# Altium project Boost Converter UVEEC.PrjPcb
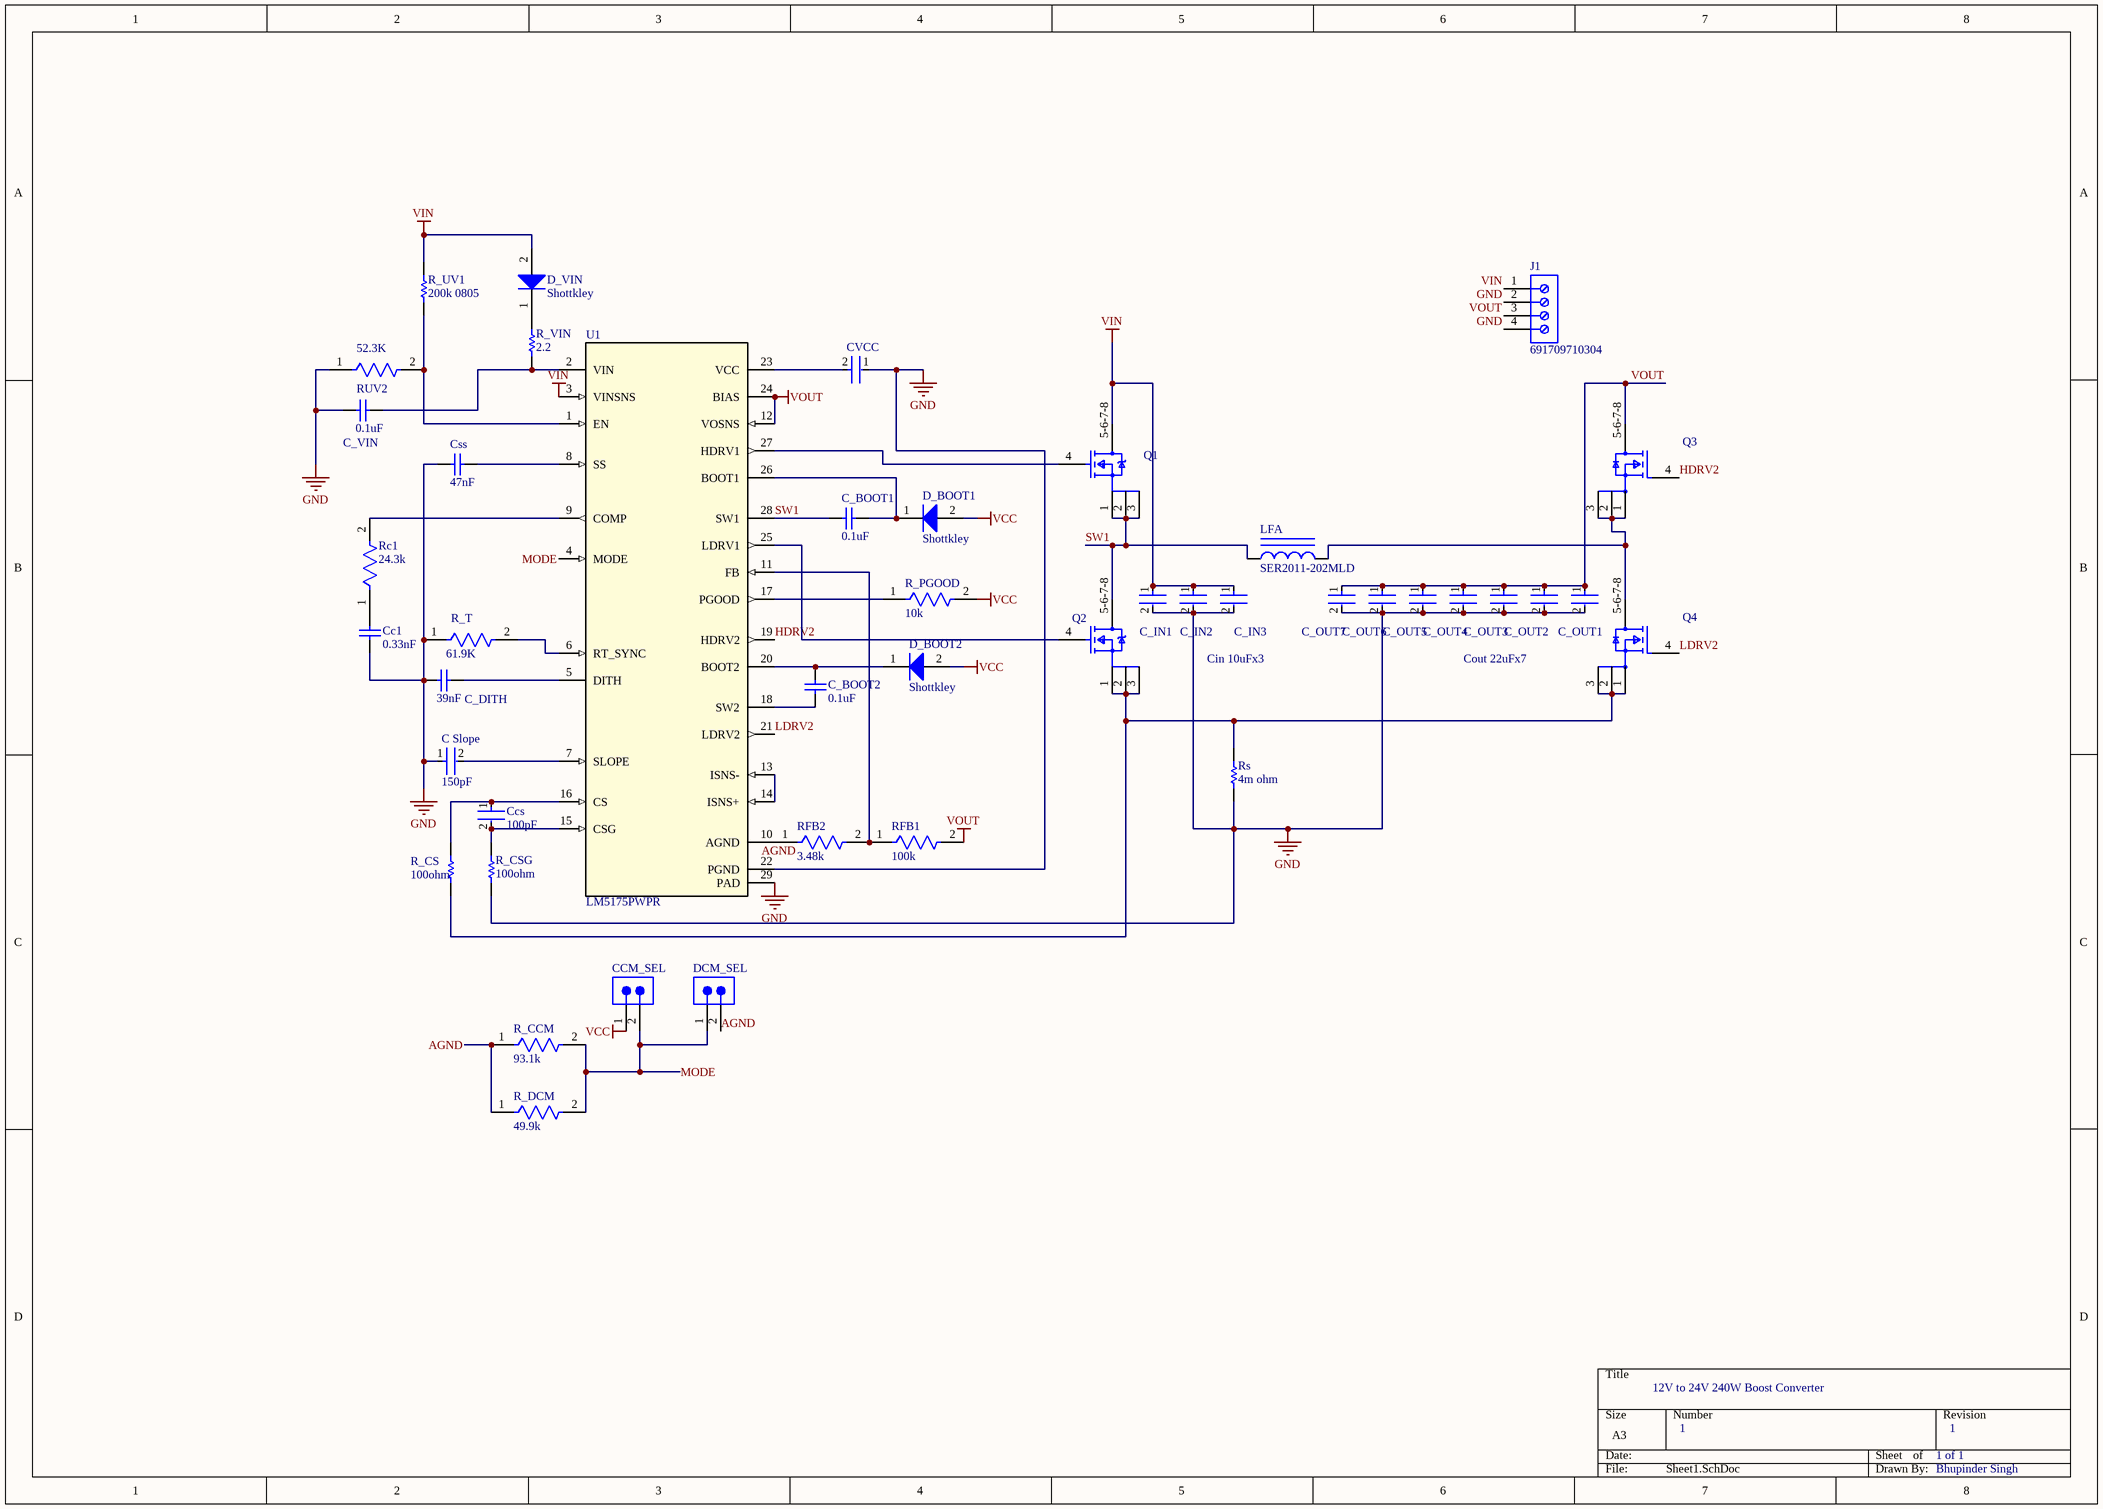
[diagram p0: Sheet1.SchDoc]
1 sheet, 44 parts. Net scope: global (net labels, ports and power ports of the same name join across sheets).

## Sheet Sheet1.SchDoc
size A3; SheetNumber: 1; SheetTotal: 1

### Parts
52.3K  RUV2  [FP-RG2012-IPC_A]
C_BOOT1  0.1uF  [CAPC1608X90X35ML10T15]
C_BOOT2  0.1uF  [CAPC1608X90X35ML10T15]
C_DITH  39nF  [CAPC1608X90X35NL15T15]
C_IN1  C0805C106K8PACTU  [FP-C0805C-DG-MFG]  (value not drawn)
C_IN2  C0805C106K8PACTU  [FP-C0805C-DG-MFG]  (value not drawn)
C_IN3  C0805C106K8PACTU  [FP-C0805C-DG-MFG]  (value not drawn)
C_OUT1  GRM21BR60J226ME39L  [FP-GRM21B-0_15-MFG]  (value not drawn)
C_OUT2  GRM21BR60J226ME39L  [FP-GRM21B-0_15-MFG]  (value not drawn)
C_OUT3  GRM21BR60J226ME39L  [FP-GRM21B-0_15-MFG]  (value not drawn)
C_OUT4  GRM21BR60J226ME39L  [FP-GRM21B-0_15-MFG]  (value not drawn)
C_OUT5  GRM21BR60J226ME39L  [FP-GRM21B-0_15-MFG]  (value not drawn)
C_OUT6  GRM21BR60J226ME39L  [FP-GRM21B-0_15-MFG]  (value not drawn)
C_OUT7  GRM21BR60J226ME39L  [FP-GRM21B-0_15-MFG]  (value not drawn)
C_Slope  150pF  [FP-0805-L_2_01_0_2-W_1_25-IPC_B]
C_VIN  0.1uF  [CAPC1608X90X35ML10T15]
Cc1  0.33nF  [CAPC1608X92X38LL15T08]
CCM_SEL  61300211121  [61300211121]  (value not drawn)
Ccs  100pF  [FP-C0805C-DN-MFG]
Css  47nF  [CAPC1608X90X35NL15T15]
CVCC  C1608X5R1H105K080AB  [FP-C1608-080-0_1-IPC_B]  (value not drawn)
D_BOOT1  Shottkley  [ONSC-SOD-323-2-477-02_V]
D_BOOT2  Shottkley  [ONSC-SOD-323-2-477-02_V]
D_VIN  Shottkley  [ONSC-SOD-323-2-477-02_V]
DCM_SEL  61300211121  [61300211121]  (value not drawn)
J1  691709710304  [691709710304]
LF  SER2011-202MLD  [COIL-SER2011-3_V]  (part A of 2)
Q1  CSD18563Q5A  [FP-DQJ0008A-MFG]  (value not drawn)
Q2  CSD18563Q5A  [FP-DQJ0008A-MFG]  (value not drawn)
Q3  CSD16321Q5  [FP-DQH0008A-0]  (value not drawn)
Q4  CSD16321Q5  [FP-DQH0008A-0]  (value not drawn)
R_CCM  93.1k  [FP-RN732A-MFG]
R_CS  100ohm  [RESC1608X55X30LL15T15]
R_CSG  100ohm  [RESC1608X55X30LL15T15]
R_DCM  49.9k  [FP-CRCW0805-e3-IPC_C]
R_PGOOD  10k  [FP-RR0510-MFG]
R_T  61.9K  [FP-RG2012-IPC_A]
R_UV1  200k 0805  [RESC2013X70X40LL20T20]
R_VIN  2.2  [RESC1609X50X30LL10T20]
Rc1  24.3k  [FP-CR1206-MFG]
RFB1  100k  [FP-RC0603-0_55-MFG]
RFB2  3.48k  [FP-ERA3A-IPC_A]
Rs  value 4m ohm  (hidden comment: Resistor)
U1  LM5175PWPR  [PWP0028F_N]

### Nets
GND: 52.3K.1 C_DITH.1 C_IN1.2 C_IN2.2 C_IN3.2 C_OUT1.2 C_OUT2.2 C_OUT3.2 C_OUT4.2 C_OUT5.2 C_OUT6.2 C_OUT7.2 C_Slope.1 C_VIN.1 Cc1.1 Css.1 CVCC.1 J1.2 J1.4 R_CSG.1 R_T.1 Rs.1 U1.22(PGND) U1.29(PAD)
VCC: CCM_SEL.1 D_BOOT1.2(A) D_BOOT2.2(A) R_PGOOD.2
VIN: C_IN1.1 C_IN2.1 C_IN3.1 D_VIN.2(A) J1.1 Q1.5-6-7-8(D) R_UV1.2 U1.3(VINSNS)
VOUT: C_OUT1.1 C_OUT2.1 C_OUT3.1 C_OUT4.1 C_OUT5.1 C_OUT6.1 C_OUT7.1 J1.3 Q3.5-6-7-8(D) RFB1.2 U1.12(VOSNS) U1.24(BIAS)
AGND: DCM_SEL.2 R_CCM.1 R_DCM.1
HDRV2: Q3.4(G) U1.19(HDRV2)
LDRV2: Q4.4(G) U1.21(LDRV2)
MODE: CCM_SEL.2 DCM_SEL.1 R_CCM.2 R_DCM.2 U1.4(MODE)
SW1: C_BOOT1.1 LF.1 Q1.1(S) Q1.2(S) Q1.3(S) Q2.5-6-7-8(D) U1.28(SW1)
Net52.3K_2: 52.3K.2 R_UV1.1 U1.1(EN)
NetC_BOOT1_2: C_BOOT1.2 D_BOOT1.1(K) U1.26(BOOT1)
NetC_BOOT2_1: C_BOOT2.1 D_BOOT2.1(K) U1.20(BOOT2)
NetC_BOOT2_2: C_BOOT2.2 U1.18(SW2)
NetC_DITH_2: C_DITH.2 U1.5(DITH)
NetC_Slope_2: C_Slope.2 U1.7(SLOPE)
NetC_VIN_2: C_VIN.2 R_VIN.1 U1.2(VIN)
NetCc1_2: Cc1.2 Rc1.1
NetCcs_1: Ccs.1 R_CS.2 U1.16(CS)
NetCcs_2: Ccs.2 R_CSG.2 U1.15(CSG)
NetCss_2: Css.2 U1.8(SS)
NetCVCC_2: CVCC.2 U1.23(VCC)
NetD_VIN_1: D_VIN.1(K) R_VIN.2
NetLF_2: LF.2 Q3.1(S) Q3.2(S) Q3.3(S) Q4.5-6-7-8(D)
NetQ1_4: Q1.4(G) U1.27(HDRV1)
NetQ2_1: Q2.1(S) Q2.2(S) Q2.3(S) Q4.1(S) Q4.2(S) Q4.3(S) R_CS.1 Rs.2
NetQ2_4: Q2.4(G) U1.25(LDRV1)
NetR_PGOOD_1: R_PGOOD.1 U1.17(PGOOD)
NetR_T_2: R_T.2 U1.6(RT_SYNC)
NetRc1_2: Rc1.2 U1.9(COMP)
NetRFB1_1: RFB1.1 RFB2.2 U1.11(FB)
NetRFB2_1: RFB2.1 U1.10(AGND)
NetU1_13: U1.13(ISNS-) U1.14(ISNS+)

### Notes on the sheet
- Cin 10uFx3
- Cout 22uFx7
- 12V to 24V 240W Boost Converter
- 1
- 1 of 1
- Bhupinder Singh
- Labels drawn without touching a wire or pin: AGND

### Library data of the parts
52.3K = CMP-28537-010509-1: Automotive Metal Thin Film Chip Resistor, 0805, 52.3kΩ, 0.1%, 25ppm/°C, 0.125W, 150V; Power Rating: 125mW; Resistance: 52.3kR; Height: 0.4mm; Voltage Rating (DC): 150V; Voltage Rating: 150V; Weight: 0.000194oz; Case Code (Metric): 2012; Features: Automotive AEC-Q200; Number of Terminations: 2; Temperature Coefficient: 25ppm/°C; Width: 1.2mm; Termination: SMD/SMT; Min Operating Temperature: -55°C; Resistor Type: Thin Film; Tolerance: 0.1%; Lead Free: Lead Free; Length: 2mm; Packaging: Tape and Reel; Max Power Dissipation: 125mW; RoHS Compliant: Yes; Series: RG; Max Operating Temperature: 155°C; Case/Package: 0805; Case Code (Imperial): 0805
C_BOOT1 C_BOOT2 C_VIN = CMP-2100-03643-1: Chip Capacitor, 0.1 uF, +/- 10%, 50 V, -55 to 125 degC, 0603 (1608 Metric), RoHS, Tape and Reel; Manufacturer: Murata; Dielectric Material: Ceramic; Voltage Rating: 50V; Capacitance: 100nF; Dielectric: X7R; Insulation Resistance: 10GR; Value: 100nF; Case Code (Metric): 1608; Lead Free: LeadFree; Depth: 0.8mm; Number of Pins: 2; Radiation Hardening: No; Case/Package: 0603; Manufacturer URL: http://www.murata.com/; Packaging: TapeandReel; Length: 1.6mm; Contact Plating: Tin; Datasheet URL: http://psearch.en.murata.com/capacitor/product/GRM188R71H104KA93%23.pdf; Tolerance: 10%; Case Code (Imperial): 0603; Min Operating Temperature: -55degC; RoHSCompliant: true; Voltage: 50V; Termination: SMD/SMT; Mount: SurfaceMount; Material: Ceramic; Package Quantity: 1; Height: 0.8mm; Thickness: 0.035inch; REACH SVHC: NoSVHC; Max Operating Temperature: 125degC; Width: 0.8mm; Package Reference: 0603; Voltage Rating (DC): 50V; Datasheet Version: 42675.0; Package Description: 2-Pin Surface Mount Device, Body 1.6 x 0.8 mm
C_DITH = CMP-2006-04434-1: Manufacturer: AVX Interconnect / Elco; Part Number: 06035C393KAT2A
C_IN1-C_IN3 = CMP-2007-03243-2: CAP CER 10UF 10V X5R 0805; Manufacturer: Kemet; 3DS Part Number: 220-00001; Tolerance: 10%; Temperature Coefficient: 15%; Device Class L2: Capacitors; Device Class L1: Passive Components; ComponentLink2URL: https://content.kemet.com/datasheets/KEM_C1006_X5R_SMD.pdf; Height: 1.4mm; Lead Free: Yes; Manufacturer Part Number: C0805C106K8PACTU; Digikey Description: CAP CER 10UF 10V X5R 0805; Octopart: https://octopart.com/c0805c106k8pactu-kemet-98697; Capacitance: 10uF; Value: 10uF; Temperature Range Low: -55°C; Temperature: -55°C to +85°C; Automotive: No; Mouser Description: CAP CER 10UF 10V X5R 0805; Ipc Land Pattern Name: CAPC200125X125; Material: Ceramic; Temperature Range High: +85°C; Voltage: 10V; RoHS: TRUE; Device Class L3: Ceramic Capacitors; ComponentLink2Description: Datasheet; Voltage Rating: 10V; Package: C0805C-DG; Temperature Characteristic: X5R; Category: Cap
C_OUT1-C_OUT7 = CMP-2007-03385-2: Chip Multilayer Ceramic Capacitors for General Purpose, 0805, 22uF, X5R, 15%, 20%, 6.3V; Material: Ceramic; Max Operating Temperature: 85°C; Voltage: 6.3V; Min Operating Temperature: -55°C; Case/Package: 0805; Thickness: 0.053inch; Dielectric: X5R; Packaging: Tape and Reel; Depth: 1.25mm; Termination: SMD/SMT; Voltage Rating (DC): 6.3V; Radiation Hardening: No; Tolerance: 20%; Mount: Surface Mount; Lead Free: Lead Free; Package Quantity: 1; REACH SVHC: No SVHC; Voltage Rating: 6.3V; Capacitance: 22uF; Length: 2mm; Case Code (Imperial): 0805; Case Code (Metric): 2012; Width: 0.049inch; Height: 1.25mm; Value: 22uF
C_Slope = CMP-2007-04584-2: General Purpose Ceramic Capacitor, 0805, 150pF, 5%, C0G, 30ppm/°C, 200V; Dissipation Factor: 10%; Depth: 1.25mm; Contact Plating: Tin; Number of Pins: 2; Width: 1.25mm; Tolerance: 5%; Mount: Surface Mount; REACH SVHC: No SVHC; Voltage Rating (DC): 200V; Dielectric: C0G; Height: 0.94mm; Max Operating Temperature: 125°C; Package Quantity: 1; Temperature Coefficient: 30ppm/°C; RoHS Compliant: Yes; Series: -; Lead Free: Lead Free; Thickness: 0.037inch; Voltage Rating: 200V; Case Code (Imperial): 0805; Capacitance: 150pF; Min Operating Temperature: -55°C; Radiation Hardening: No; Length: 2.01mm; Construction: Flat; Case/Package: 0805; Packaging: Tape and Reel; Case Code (Metric): 2012; Voltage: 200V; Termination: SMD/SMT
Cc1 = CMP-2006-01514-1: Manufacturer: Vitramon; Part Number: VJ0603D331KXAAJ
CCM_SEL DCM_SEL = CMP-1712-00002-5: NexarPartId: 20081794; Operating Supply Voltage: 250V; Current Rating: 3A; Gender: Male; Number of Contacts: 2; Pitch: 2.54mm; Connector Type: Male Pin; Contact Resistance: 20mΩ; Contact Plating: Gold; Contact Material: Copper; Number of Pins: 2; Min Operating Temperature: -40°C; Packaging: Bulk; Lead Pitch: 2.54mm; Mount: Through Hole; Orientation: Vertical; RoHS: Compliant; REACH SVHC: No SVHC; Height: 8.94mm; Termination: Through Hole; Number of Positions: 2; Contact Mating Length: 5.9944mm; Color: Black; Contact Gender: Male; Number of Rows: 1; Housing Material: PBT; Lead Free: Lead Free; Voltage Rating: 250V; Max Operating Temperature: 125°C
Ccs = CMP-03020-014281-1: CAP CER 100PF 100V C0G/NP0 0805; Manufacturer: KEMET; Manufacturer Part Number: C0805C101J1GACTU; Temperature Coefficient: 30ppm/°C; Temperature Characteristic: C0G; Tolerance: 0.05; RoHS: TRUE; ComponentLink2URL: https://content.kemet.com/datasheets/KEM_C1003_C0G_SMD.pdf; Voltage Rating: 100 V; Height: 0.88mm; Capacitance: 100 pF; Device Class L3: Ceramic Capacitors; Temperature: -55°C to +125°C; Digikey Description: CAP CER 100PF 100V C0G/NP0 0805; Device Class L1: Passive Components; Lead Free: Yes; Package: C0805C-DN; Octopart: https://octopart.com/c0805c101j1gactu-kemet-123666; Automotive: No; Category: Cap; Temperature Range High: +125°C; Mouser Description: Multilayer Ceramic Capacitors MLCC - SMD/SMT 100volts 100pF C0G 5%; Temperature Range Low: -55°C; ComponentLink2Description: Datasheet; Ipc Land Pattern Name: CAPC200125X78; Material: Ceramic; Device Class L2: Capacitors; Value: 100 pF
Css = CMP-2006-02074-1: Part Number: 06035C473KAZ2A; Manufacturer: AVX Interconnect / Elco
CVCC = CMP-2000-06025-2: Multilayer Ceramic Capacitors 1μF ±10% 50V X5R SMD 0603; Capacitance: 1uF; Value: 1uF; Lead Free: Lead Free; Height: 0.8mm; Mount: Surface Mount; Radiation Hardening: No; Thickness: 0.035inch; Length: 1.6mm; Max Operating Temperature: 85°C; REACH SVHC: No SVHC; Min Operating Temperature: -55°C; Construction: Flat; RoHS Compliant: Yes; Voltage Rating: 50V; Dielectric: X5R; Packaging: Tape and Reel; Termination: SMD/SMT; Voltage Rating (DC): 50V; Case Code (Imperial): 0603; Voltage: 50V; Width: 0.031inch; Weight: 7.1E-05oz; Depth: 0.8mm; Case Code (Metric): 1608; Series: C; Case/Package: 0603; Tolerance: 10%; Resistor Type: Ceramic; Number of Pins: 2; Dielectric Material: Ceramic; Package Quantity: 1
D_BOOT1 D_BOOT2 D_VIN = CMP-1055-00462-1: Schottky Barrier Diode, 2-Pin SOD-323, Pb-Free, Tape and Reel; PartNumber: BAT54HT1G; Manufacturer: On Semiconductor; Configuration: Single; trr Max (ns): 5; IFSM Max (A): 0.6; ComponentLink3URL: http://www.onsemi.com/pub_link/Collateral/477-02.PDF.1; PackageDescription: 2-Pin SOD, Body 1.7 x 1.25 mm; ComponentLink2URL: http://www.onsemi.cn/pub_link/Collateral/BAT54HT1-D.PDF; ComponentLink3Description: Package Specification; ComponentLink2Description: Datasheet; DatasheetVersion: Rev. 6; PackageReference: SOD-323-2-477-02; RoHS: TRUE; ComponentLink1URL: http://www.onsemi.com/; Packing: Tape and Reel; Mounting Technology: Surface Mount; ComponentLink1Description: Manufacturer URL; PackageVersion: Rev. H, 03/2007
J1 = CMP-1502-03337-2: NexarPartId: 34171771; Current: 6A; Voltage: 300V; Number of Positions Per Level: 4; Plating: Steel; Wire Gauge (Max): 30AWG; Pitch: 5mm; Connector Type: Screw; Number of Levels: 1; Color: Black; Lead Pitch: 5mm; Mount: Surface Mount; Flammability Rating: UL94 V-0; Termination: Screw; Housing Material: Nylon; Min Operating Temperature: -40°C; REACH SVHC: Unknown; Number of Pins: 4; Contact Plating: Tin; Packaging: Digi-Reel®; Height: 10.2mm; Number of Rows: 1; Number of Positions: 4; Contact Material: Nickel; Current Rating: 6A; Wire Gauge (Min): 30AWG; Voltage Rating: 300V; Length: 20mm; Wire/Cable Gauge: 30AWG; RoHS: Compliant; Number of Contacts: 4; Max Operating Temperature: 130°C
LF = CMP-0837-00036-1: Shielded Power Inductor, 2 uH, +/- 20%, 1.2 mOhm, 56 MHz, 37 A, -40 to 125 degC, 3-Pin SMD, RoHS, Reel; Manufacturer: Coilcraft; DCR typ (mOhm): 1.2; SRF typ (MHz): 56; Inductance +/- 20% (uH): 2; Isat (A): 37; ComponentLink3Description: Package Specification; Ambient Temperature with Derated Current: 85 to 125 degC; Mounting Technology: Surface Mount; PackageReference: SER2011-3; PartNumber: SER2011-202MLD; Packing: Reel; DatasheetVersion: 09/2012; PackageDescription: 3-Pin SMD, Body 19.18 x 9.27 mm, Height 10.67 mm; ComponentLink2URL: http://www.coilcraft.com/pdfs/ser2000.pdf; ComponentLink3URL: http://www.coilcraft.com/pdfs/ser2000.pdf; Ambient Temperature with Irms Current: -40 to 85 degC; PackageVersion: 09/2012; ComponentLink1URL: http://www.coilcraft.com/; ComponentLink1Description: Manufacturer URL; RoHS: TRUE; ComponentLink2Description: Datasheet
Q1 Q2 = CMP-04962-000004-1: MOSFET N-CH 60V 100A 8SON; Manufacturer: Texas Instruments; Threshold Vgs Max: 2.4V; Number Of Channels: 1; Input Capacitace At Vds: 1150pF @ 30V; Gate Charge At Vgs: 15nC @ 10V; Reverse Recovery Charge: 63nC; Max Junction Temp: +150°C; Max Forward Diode Voltage: 1V; Power Dissipation: 3.2W; Reverse Recovery Time: 49ns; Rthja Max: 50°C/W; Typ Forward Diode Voltage: 0.8V; Turn On Delay Time: 3.2ns; Threshold Vgs Min: 1.7V; Drain To Source Resistance: 5.7mΩ; Turn Off Delay Time: 11.4ns; Transconductance: 60S; Gate To Source Voltage: 20V; Continuous Drain Current: 15A; Package: DQJ0008A; Temperature Range High: +150°C; Device Class L3: MOSFETs; Device Class L2: Transistors; Manufacturer Part Number: CSD18563Q5A; RoHS: TRUE; Number Of N Channels: 1; Automotive: No; Lead Free: Yes; Digikey Description: MOSFET N-CH 60V 100A 8SON; Drain To Source Breakdown Voltage: 60V; Temperature Range Low: -55°C; Temperature: -55°C to +150°C; Category: Trans; Device Class L1: Discrete Semiconductors; Height: 1.1mm; Octopart: https://octopart.com/csd18563q5a-texas+instruments-30331677; ComponentLink2Description: Datasheet; ComponentLink2URL: http://www.ti.com/lit/ds/symlink/csd18563q5a.pdf; Drain To Source Voltage: 60V; Mouser Description: MOSFET 60V N-Channel NexFET Power MOSFET
Q3 Q4 = CMP-04962-000020-1: MOSFET N-CH 25V 31A/100A 8VSON; Rise Time: 15ns; Turn-Off Delay Time: 27ns; Drain to Source Resistance: 2.4mR; Gate to Source Voltage (Vgs): 10V; Turn-On Delay Time: 9ns; Threshold Voltage: 1.1V; Number of Elements: 1; Max Power Dissipation: 3.1W; Input Capacitance: 3.1nF; Continuous Drain Current (ID): 100A; Fall Time: 17ns; Element Configuration: Single; Polarity: N-CHANNEL; Package Quantity: 1; Lead Free: Contains Lead; Case/Package: SON; Radiation Hardening: No; Width: 5.1mm; Dual Supply Voltage: 25V; Series: NexFET™; RoHS Compliant: Yes; Termination: SMD/SMT; Min Operating Temperature: -55°C; Contact Plating: Tin; Packaging: Tape and Reel; Nominal Vgs: 1.1V; Number of Pins: 8; Mount: Surface Mount; Max Operating Temperature: 150°C; Drain to Source Voltage (Vdss): 25V; Drain to Source Breakdown Voltage: 25V; REACH SVHC: No SVHC; Rds On Max: 2.4mR; Length: 6.1mm; Power Dissipation: 3.1W; Height: 1.05mm
R_CCM = CMP-03211-004999-1: SMD Chip Resistor, Thin Film, 93.1KΩ, 100 V, 0805 [2012 Metric], 100 mW, 0.1%, RN73 Series; Manufacturer Part Number: RN73C2A93K1BTDF; Manufacturer: TE Connectivity; Voltage Rating: 100V; Temperature Coefficient: 10ppm/°C; Power Rating: 0.1W; RoHS: TRUE; Ipc Land Pattern Name: RESC200125X55; ComponentLink2URL: https://www.te.com/commerce/DocumentDelivery/DDEController?Action=showdoc&DocId=Data+Sheet%7F1773270%7FP%7Fpdf%7FEnglish%7FENG_DS_1773270_P.pdf%7F1676162-2; octopart_url: https://octopart.com/rn73c2a93k1btdf-te+connectivity-42431925; Lead Free: Yes; Device Class L1: Passive Components; Device Class L3: Chip SMD Resistors; Category: Res; Automotive: No; packaging: 1000 Reel; Resistance: 93.1KΩ; Height: 0.65mm; Package: RN732A; Temperature Range High: 155°C; Octopart: https://octopart.com/rn73c2a93k1btdf-te+connectivity-42431925; Temperature Range Low: -55°C; Temperature: -55°C to 155°C; Value: 93.1KΩ; Tolerance: 0.1%; Series: RN73; Device Class L2: Resistors; Composition: Thin Film; ComponentLink2Description: Datasheet
R_CS R_CSG = CMP-2000-00179-1: Manufacturer: Panasonic; Part Number: ERJ-3EKF1000V
R_DCM = CMP-2001-03952-2: RES Thick Film, 49.9kΩ, 1%, 0.125W, 100ppm/°C, 0805; Resistance: 49.9kR; Power Rating: 125mW; Voltage Rating (DC): 150V; Contact Plating: Tin; Case Code (Imperial): 0805; Package Quantity: 10; Termination: SMD/SMT; Length: 2mm; Width: 0.049inch; Case Code (Metric): 2012; Temperature Coefficient: 100ppm/°C; Tolerance: 1%; Depth: 1.25mm; Mount: Surface Mount; Lead Free: Lead Free; Min Operating Temperature: -55°C; Case/Package: 0805; Number of Terminations: 2; Composition: Thick Film; Height: 0.45mm; Voltage Rating: 150V; Max Power Dissipation: 125mW; Features: Automotive AEC-Q200; Military Standard: Not; Radiation Hardening: No; Max Operating Temperature: 155°C; Weight: 0.000194oz; Packaging: Tape and Reel
R_PGOOD = CMP-2002-01565-2: 20kΩ ±0.5% 0.0625W 1/16W Chip Resistor 0402 (1005 Metric) Thin Film; Temperature Coefficient: 25ppm/°C; Max Power Dissipation: 63mW; Voltage Rating: 25V; Resistance: 20kR; Power Rating: 62.5mW; Value: 20kR; Length: 0.039inch; Resistance Tolerance: 0.5%; Packaging: Tape and Reel; Height: 0.016inch; Number of Pins: 2; Series: RR; Termination: SMD/SMT; Case Code (Imperial): 0402; Resistor Type: Thin Film; Number of Terminations: 2; Case/Package: 0402; Width: 0.02inch; Max Operating Temperature: 125°C; Package Quantity: 1; Min Operating Temperature: -55°C; Tolerance: 0.5%; Lead Free: Lead Free; Case Code (Metric): 1005; Voltage Rating (DC): 25V; Size Code: 0402; RoHS Compliant: Yes
R_T = CMP-28537-002774-1: Automotive Metal Thin Film Chip Resistor, 0805, 61.9kΩ, 0.5%, 25ppm/°C, 0.125W, 150V; Max Power Dissipation: 125mW; Resistance: 61.9kR; Value: 61.9kR; Tolerance: 0.5%; RoHS Compliant: Yes; Packaging: Tape and Reel; Package Quantity: 5000; Height: 0.02inch; Case Code (Metric): 2012; Termination: SMD/SMT; Min Operating Temperature: -55°C; Lead Free: Lead Free; Weight: 0.000194oz; Temperature Coefficient: 25ppm/°C; Series: RG; Voltage Rating: 150V; Length: 0.079inch; Resistor Type: Thin Film; Voltage Rating (DC): 150V; Max Operating Temperature: 155°C; Width: 0.049inch; Case/Package: 0805; Features: Automotive AEC-Q200; Number of Terminations: 2; Power Rating: 125mW; Case Code (Imperial): 0805
R_UV1 = CMP-2001-00028-1: Manufacturer: Panasonic; Part Number: ERJ-6ENF2003V
R_VIN = CMP-2000-03207-1: Part Number: CRCW06032R20FNEA; Manufacturer: Vishay Dale
Rc1 = CMP-07231-005081-1: Thick Film Chip Resistors 1206 24.3kΩ 0.25W 1% 100ppm/°C; Max Power Dissipation: 250mW; Voltage Rating: 200V; Resistance: 24.3kR; Radiation Hardening: No; Height: 0.03inch; Case/Package: 1206; Contact Plating: Tin; Width: 0.063inch; Max Operating Temperature: 155°C; Packaging: Tape and Reel; Mount: Surface Mount; Power Rating: 250mW; Package Quantity: 5000; Case Code (Imperial): 1206; Tolerance: 1%; Temperature Coefficient: 100ppm/°C; Case Code (Metric): 3216; Thickness: 610um; Termination: SMD/SMT; Min Operating Temperature: -55°C; Composition: Thick Film; Depth: 1.6mm; Length: 3.2mm; Military Standard: Not; Features: Moisture Resistant; Number of Terminations: 2
RFB1 = CMP-2100-03662-2: RES SMD 100K OHM 1% 1/10W 0603; Voltage Rating (DC): 50V; Resistance: 100kR; Max Power Dissipation: 100mW; Temperature Coefficient: 100ppm/°C; Working Voltage: 75V; Value: 100kR; Length: 1.6mm; Lead Free: Lead Free; Number of Terminations: 2; Packaging: Tape and Reel; Voltage Rating: 50V; Termination: SMD/SMT; Width: 0.8mm; Resistor Type: Thick Film; Resistance Tolerance: 1%; Features: Moisture Resistant; Height: 0.45mm; Construction: Rectangular; Case/Package: 0603; Military Standard: Not; Case Code (Imperial): 0603; Series: RC; Technology: THICK FILM; Depth: 0.8mm; RoHS Compliant: Yes; REACH SVHC: No SVHC; Min Operating Temperature: -55°C; Case Code (Metric): 1608; Max Operating Temperature: 155°C; Power Rating: 100mW; Number of Pins: 2; Tolerance: 1%
RFB2 = CMP-05422-000099-1: RES SMD 3.48KOHM 0.1% 1/10W 0603; Voltage Rating (DC): 75V; Temperature Coefficient: 25ppm/°C; Power Rating: 100mW; Resistance: 3.48kR; Voltage Rating: 150V; Value: 3.48kR; Case Code (Imperial): 0603; Length: 1.6mm; Mount: Surface Mount; Max Operating Temperature: 155°C; Height: 0.45mm; Lead Free: Lead Free; Military Standard: Not; Construction: Rectangular; Resistor Type: Thin Film; Package Quantity: 1; Min Operating Temperature: -55°C; Features: Automotive AEC-Q200; Technology: METAL FILM; Contact Plating: Tin; Case Code (Metric): 1608; Case/Package: 0603; Radiation Hardening: No; Number of Terminations: 2; Packaging: Tape and Reel; Width: 0.8mm; Tolerance: 0.1%; Series: ERA-3A; RoHS Compliant: Yes; Max Power Dissipation: 100mW; Depth: 0.8mm; Resistance Tolerance: 0.1%; Number of Pins: 2
Rs = Resistor: 4m resistor https://www.digikey.ca/en/products/detail/stackpole-electronics-inc/CSNL2512FT4L00/1646114; TC1: 0; SimulationGenericComponent: True; TC2: 0
U1 = LM5175PWPR: No Description Available; Mfr_Name: Texas Instruments; CompType: IC; TYPE: TYPE; RefDes: RefDes; PartNumber: LM5175PWP; PackageReference: PWP0028F; MountType: SMT; RoHS: Y; Manufacturer: Texas Instruments